# Altium schematic sheet 07 Memories.SchDoc
size A
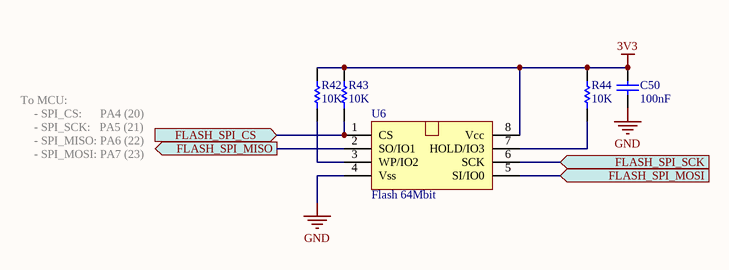
[diagram p0: 07 Memories.SchDoc]

## Parts
C50  100nF  [0603 - C]
R42  10K  [0603 - R]
R43  10K  [0603 - R]
R44  10K  [0603 - R]
U6  Flash 64Mbit  [8 - SOIC]

## Ports
FLASH_SPI_CS (in), FLASH_SPI_MISO (out), FLASH_SPI_MOSI (in), FLASH_SPI_SCK (in)

## Nets
3V3: C50.2 R42.2 R43.2 R44.2 U6.8(Vcc)
GND: C50.1 U6.4(Vss)
FLASH_SPI_CS: R43.1 U6.1(CS) ; port FLASH_SPI_CS
FLASH_SPI_MISO: U6.2(SO/IO1) ; port FLASH_SPI_MISO
FLASH_SPI_MOSI: U6.5(SI/IO0) ; port FLASH_SPI_MOSI
FLASH_SPI_SCK: U6.6(SCK) ; port FLASH_SPI_SCK
NetR42_1: R42.1 U6.3(WP/IO2)
NetR44_1: R44.1 U6.7(HOLD/IO3)

## Notes on the sheet
- To MCU:
- - SPI_CS:      PA4 (20)
- - SPI_SCK:   PA5 (21)
- - SPI_MOSI: PA7 (23)
- - SPI_MISO: PA6 (22)

## Library data of the parts
C50 = Cap 0603 100nF: CAP CER 100nF 50V C0G/NP0 0603 ±5%; MPN: CL10C104JB8NNNC; MFR: SAMSUNG; Company ID: VT_CAP_C0603 100nF; Voltage: 50V; Package: 0603; Value: 100nF; Size: C0603: 100nF
R42-R44 = Res 0603 10K: RES SMD 10K OHM 1% 1/10W 0603; MFR: Yageo; MPN: RC0603FR-0710KL; Company ID: VT_RES_R0603 10K; Value: 10K; Size: R0603: 10K
U6 = Flash 64Mb SOIC8: IC FLASH 64MBIT CMOS SPI 8SOIC; MFR: Cypress; MPN: S25FL164K0XMFI013; Company ID: VT_IC_Bộ nhớ 8M 02; MPN2: W25Q64JVSSIQ TR